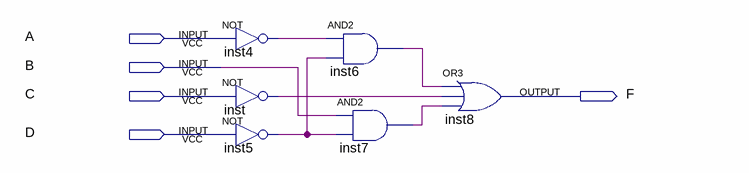
[diagram p0: schematic sheet]
// Quartus schematic lab1.bdf as structural Verilog: 6 symbols, 5 pins
module lab1 (
  input  A,
  input  B,
  input  C,
  input  D,
  output F
);

  wire inst4_out, inst5_out, inst6_out, inst7_out, inst_out;

  not inst4 (inst4_out, A);
  not inst (inst_out, C);
  not inst5 (inst5_out, D);
  and inst6 (inst6_out, inst4_out, inst5_out);
  and inst7 (inst7_out, B, inst5_out);
  or inst8 (F, inst6_out, inst_out, inst7_out);
endmodule
